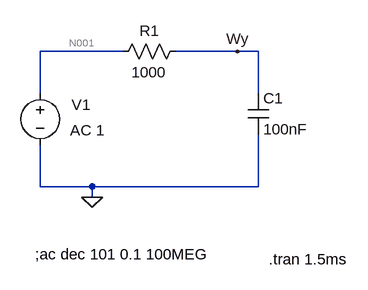
[diagram p0: schematic zad6r.asc]
zad6r.asc, the LTspice schematic file:
Version 4
SHEET 1 880 680
WIRE 64 112 -64 112
WIRE 240 112 144 112
WIRE 272 112 240 112
WIRE -64 176 -64 112
WIRE 272 176 272 112
WIRE -64 320 -64 256
WIRE 16 320 -64 320
WIRE 272 320 272 240
WIRE 272 320 16 320
WIRE 16 336 16 320
FLAG 16 336 0
FLAG 240 112 Wy
SYMBOL voltage -64 160 R0
WINDOW 3 24 44 Invisible 2
WINDOW 123 46 73 Left 2
WINDOW 39 0 0 Left 0
WINDOW 0 48 34 Left 2
SYMATTR Value PULSE(0 1 0 1n 1n 0.5ms 1ms)
SYMATTR Value2 AC 1
SYMATTR InstName V1
SYMBOL res 160 96 R90
WINDOW 0 0 56 VBottom 2
WINDOW 3 32 56 VTop 2
SYMATTR InstName R1
SYMATTR Value 1000
SYMBOL cap 256 176 R0
SYMATTR InstName C1
SYMATTR Value 100nF
TEXT -72 424 Left 2 !;ac dec 101 0.1 100MEG
TEXT 288 432 Left 2 !.tran 1.5ms

The netlist it stands for:
* zad6r.asc
V1 N001 0 PULSE(0 1 0 1n 1n 0.5ms 1ms) AC 1
R1 Wy N001 1000
C1 Wy 0 100nF
;ac dec 101 0.1 100MEG
.tran 1.5ms
.backanno
.end

* Results of the author's LTspice run, read from the files saved beside the schematic
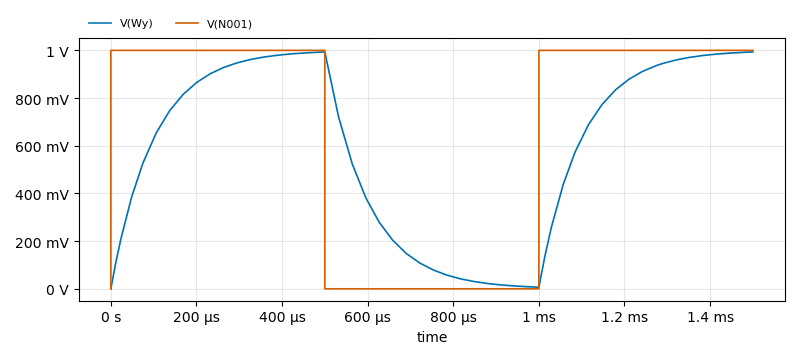
[diagram p1: Transient Analysis of zad6r.asc, plotted from the saved traces]
* Transient Analysis, 1 run:
*   V(Wy): min 0 V, max 993.3 mV, average 600.2 mV, rms 708.9 mV, last 993.3 mV
*   V(N001): min 0 V, max 1 V, average 666.7 mV, rms 816.5 mV, last 1 V